# Altium schematic sheet TOPSHEET.SchDoc: TOP SHEET
size A4; Date: 30 08 2013; Author: Rachid AKKOUCHE; CompanyName: RASoftware; Organization: RASoftware; Address1: 52 J03, rue de la crèche; Address2: 77100 MEAUX; Address3: FRANCE; DocumentNumber: BRA201308301C; Revision: C; SheetNumber: 1; SheetTotal: 11; Telephone: +33651604047; Email: rachid.akkouche@wanadoo.fr; Proprietaire: MDI; Dessinepar: Rachid AKKOUCHE; Verifiepar: -; Time: 19:00
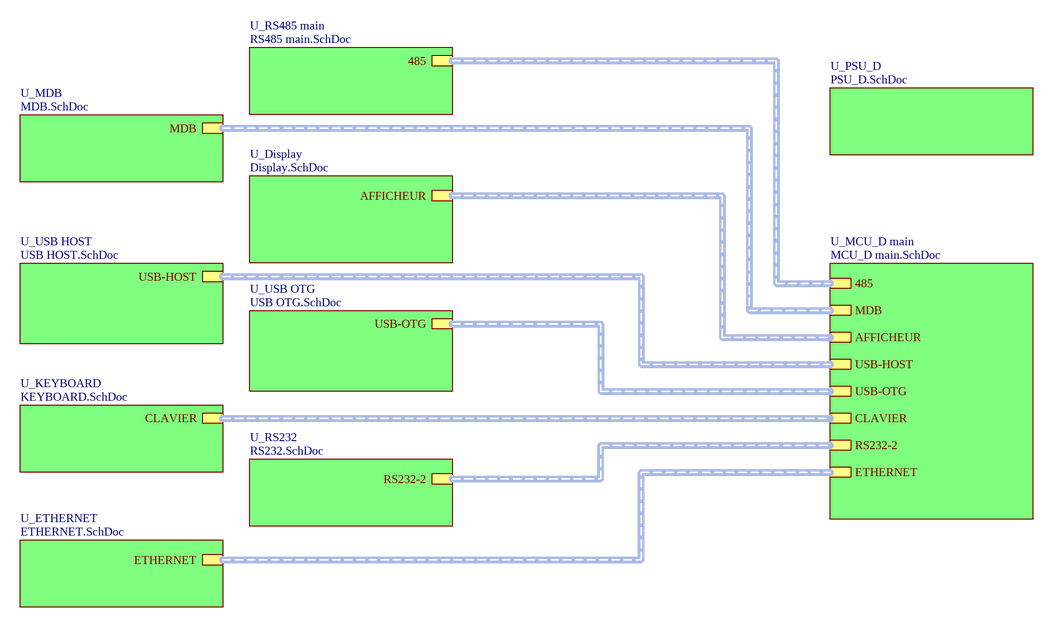
[diagram p0: TOPSHEET.SchDoc]

## Sub-sheets
U_Display = Display.SchDoc: AFFICHEUR (harness IO DISPLAY)
U_ETHERNET = ETHERNET.SchDoc: ETHERNET (harness ETHERNET)
U_KEYBOARD = KEYBOARD.SchDoc: CLAVIER (harness KEYBOARD)
U_MCU_D main = MCU_D main.SchDoc: USB-HOST (harness USB-HOST), USB-OTG (harness USG-OTG), RS232-2 (harness RS232_2), ETHERNET (harness ETHERNET), AFFICHEUR (harness IO DISPLAY), CLAVIER (harness KEYBOARD), 485 (harness EIA-485), MDB (harness MDB)
U_MDB = MDB.SchDoc: MDB (harness MDB)
U_PSU_D = PSU_D.SchDoc: no entries
U_RS232 = RS232.SchDoc: RS232-2 (harness RS232_2)
U_RS485 main = RS485 main.SchDoc: 485 (harness EIA-485)
U_USB HOST = USB HOST.SchDoc: USB-HOST (harness USB-HOST)
U_USB OTG = USB OTG.SchDoc: USB-OTG (harness USG-OTG)

## Buses and harness runs
harness sheet U_Display/AFFICHEUR = sheet U_MCU_D main/AFFICHEUR
harness sheet U_ETHERNET/ETHERNET = sheet U_MCU_D main/ETHERNET
harness sheet U_KEYBOARD/CLAVIER = sheet U_MCU_D main/CLAVIER
harness sheet U_MCU_D main/485 = sheet U_RS485 main/485
harness sheet U_MCU_D main/MDB = sheet U_MDB/MDB
harness sheet U_MCU_D main/RS232-2 = sheet U_RS232/RS232-2
harness sheet U_MCU_D main/USB-HOST = sheet U_USB HOST/USB-HOST
harness sheet U_MCU_D main/USB-OTG = sheet U_USB OTG/USB-OTG

## Notes on the sheet
- Ce document est la propriété de
- Project:
- Il ne peut être divulgué sans l'accord écrit de l'un de ses représentants dûment mandaté
- Title:
- Number:
- Date:
- Time:
- Size:
- A4
- Revision:
- Sheet
- of
- 52 J03 rue de la crèche
- Draw by:
- 77100 Meaux